# Altium schematic sheet Power.SchDoc
size 431 x 279 mm; SheetNumber: 1; SheetTotal: 4
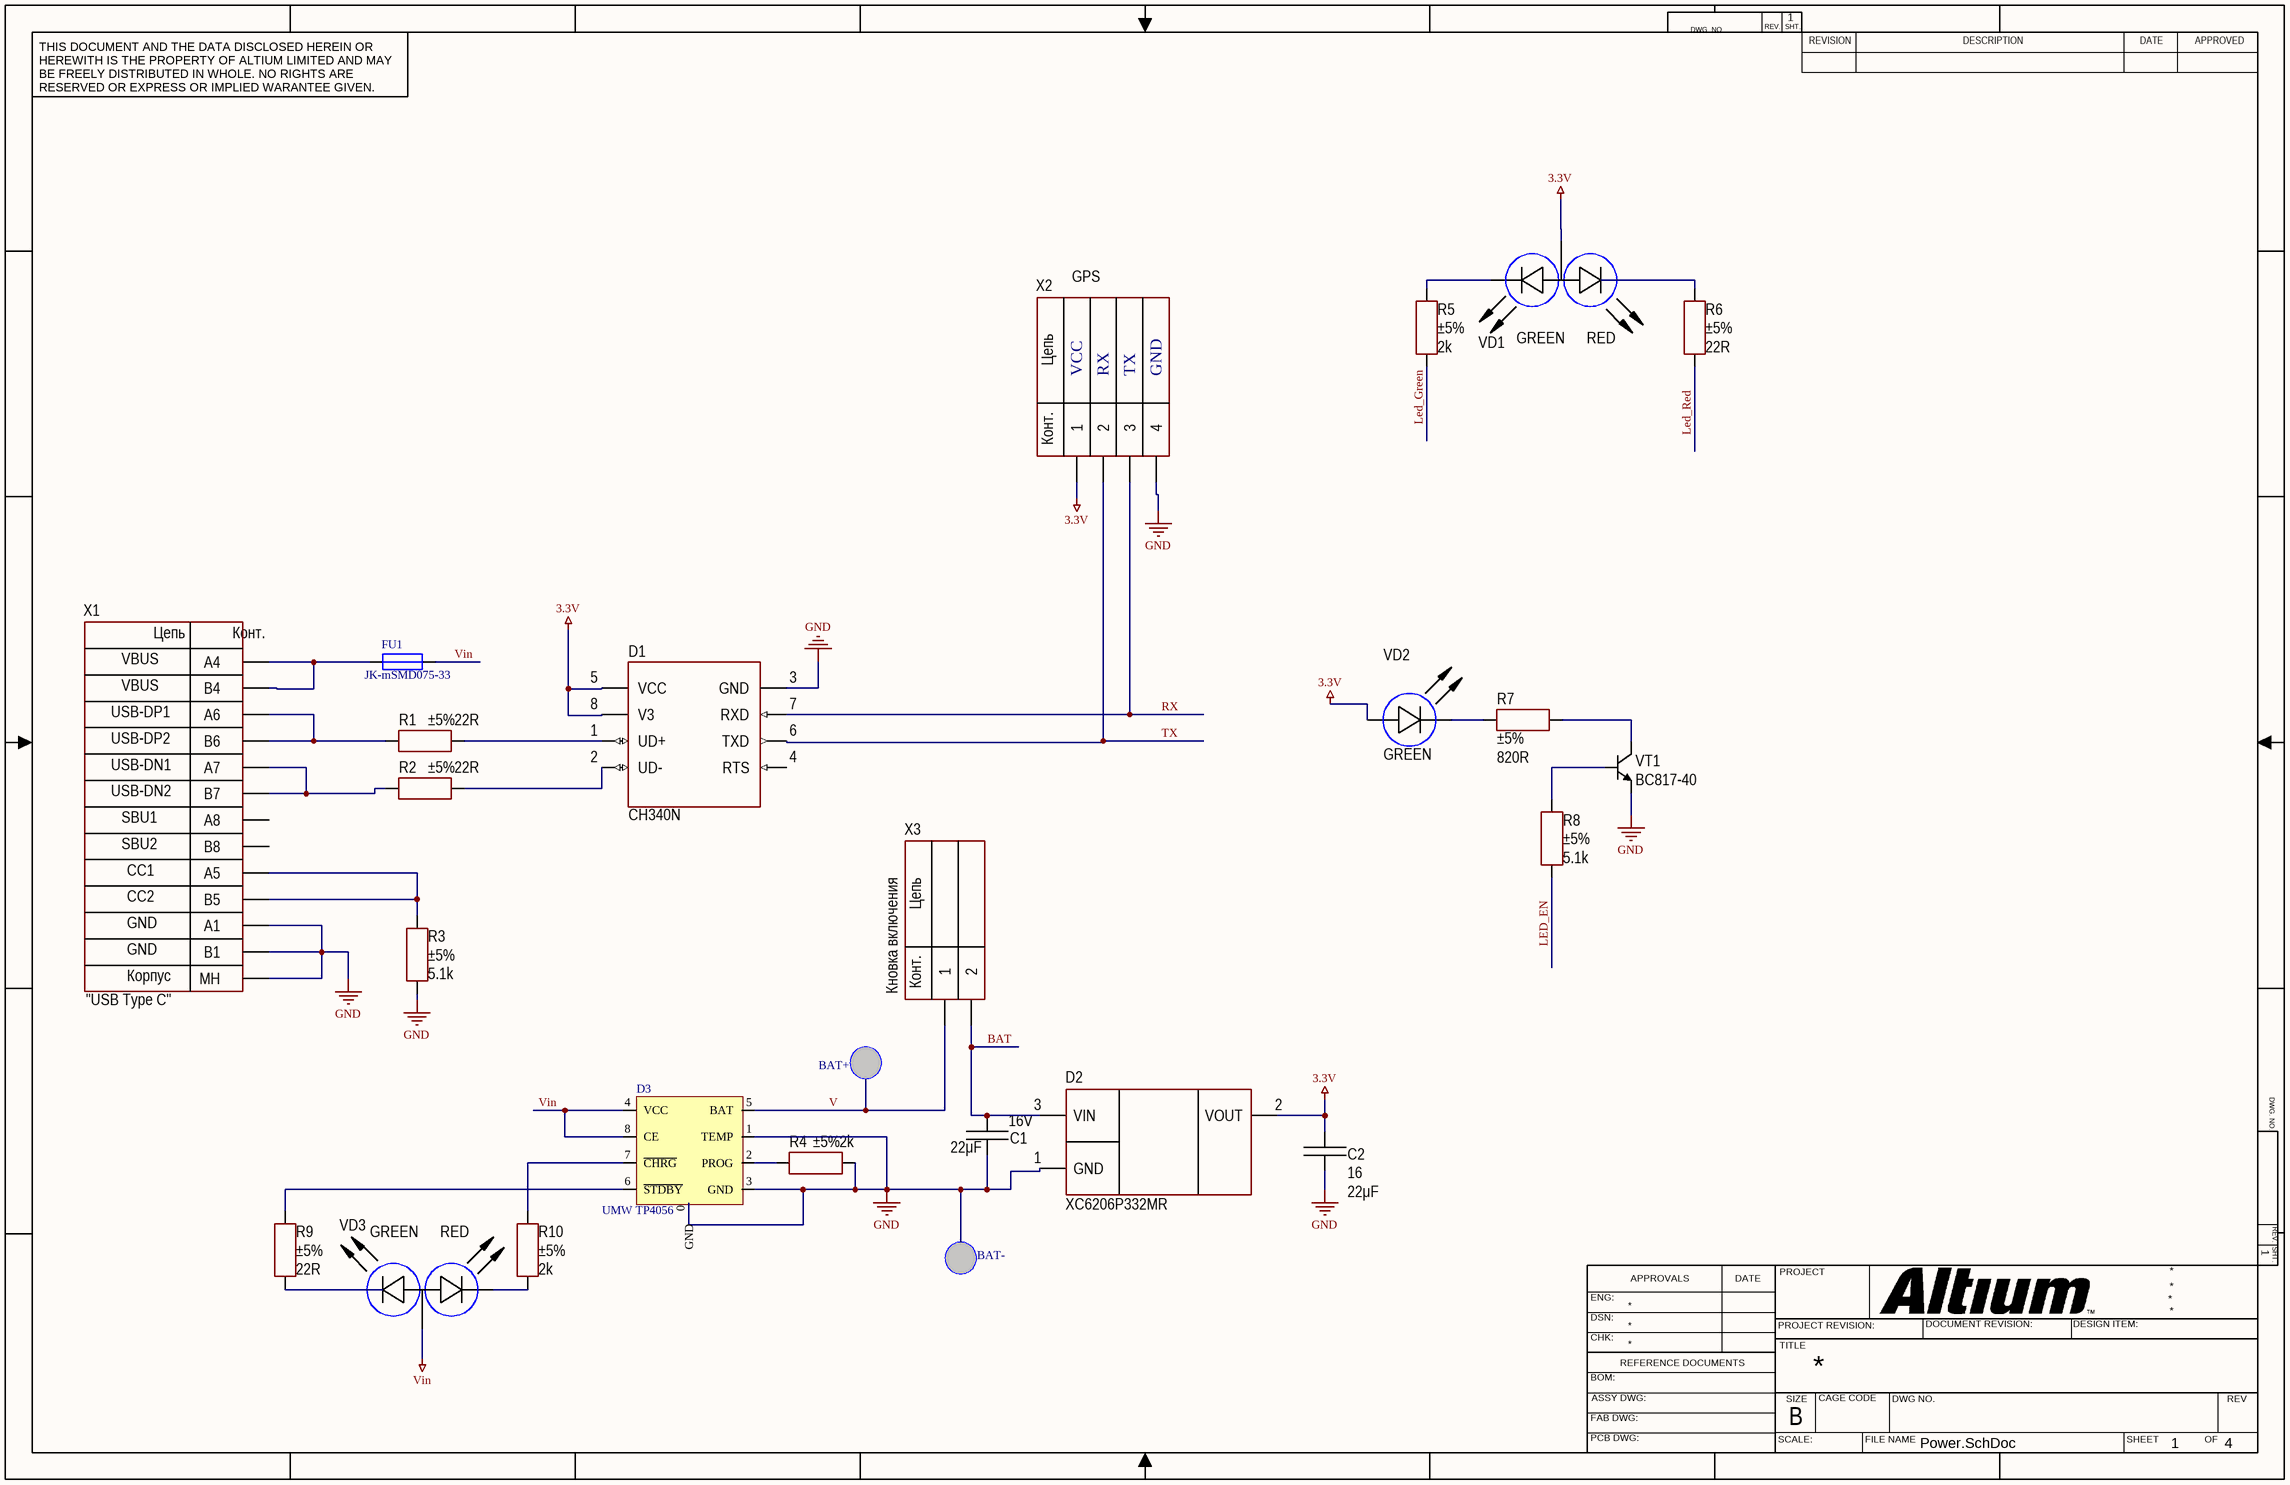
[diagram p0: Power.SchDoc]

## Parts
C1  value 22μF  Voltage: 16V  [CAP: 1206]
C2  value 22μF  Voltage: 16  [CAP: 1206]
D1  (no value)  [8-SOIC]
D2  PartNumber: XC6206P332MR  [SOT23]
D3  UMW TP4056  [SOP-8]
FU1  JK-mSMD075-33  [FUSE: 1812]
R1  value 22R  Tolerance: ±5%  [RES: 0805]
R2  value 22R  Tolerance: ±5%  [RES: 0805]
R3  value 5.1k  Tolerance: ±5%  [RES: 0805]
R4  value 2k  Tolerance: ±5%  [RES: 0805]
R5  value 2k  Tolerance: ±5%  [RES: 0805]
R6  value 22R  Tolerance: ±5%  [RES: 0805]
R7  value 820R  Tolerance: ±5%  [RES: 0805]
R8  value 5.1k  Tolerance: ±5%  [RES: 0805]
R9  value 22R  Tolerance: ±5%  [RES: 0805]
R10  value 2k  Tolerance: ±5%  [RES: 0805]
VD1  Color: GREEN      RED  [DIODE: LED3MM_DUAL]
VD2  Color: GREEN  [DIODE: LED3MM_Y]
VD3  Color: GREEN      RED  [DIODE: LED3MM_DUAL]
VT1  PartNumber: ВС817-40  [SOT23]
X1  CommentText: "USB Type C"  [CON: TYPE-C-31-M-12]
X2  CommentText: GPS  [CON: PLS-4]
X3  CommentText: Кновка включения  [CON: PLS-2]

## Nets
3.3V: C2.2 D1.5(VCC) D1.8(V3) D2.2(VOUT) VD1.2(A) VD2.1(A) X2.1
GND: C1.1 C2.1 D1.3(GND) D2.1(GND) D3.0(GND) D3.1(TEMP) D3.3(GND) R3.1 R4.2 VT1.2(E) X1.A1 X1.B1 X1.MH X2.4
Vin: D3.4(VCC) D3.8(CE) FU1.2 VD3.2(A)
BAT: C1.2 D2.3(VIN) X3.2
LED_EN: R8.2
Led_Green: R5.2
Led_Red: R6.2
RX: D1.7(RXD) X2.3
TX: D1.6(TXD) X2.2
V: D3.5(BAT) X3.1
NetD1_1: D1.1(UD+) R1.2
NetD1_2: D1.2(UD-) R2.2
NetD3_2: D3.2(PROG) R4.1
NetD3_6: D3.6(~{STDBY}) R9.2
NetD3_7: D3.7(~{CHRG}) R10.2
NetFU1_1: FU1.1 X1.A4 X1.B4
NetR1_1: R1.1 X1.A6 X1.B6
NetR2_1: R2.1 X1.A7 X1.B7
NetR3_2: R3.2 X1.A5 X1.B5
NetR5_1: R5.1 VD1.3(C)
NetR6_1: R6.1 VD1.1(C)
NetR7_1: R7.1 VD2.2(C)
NetR7_2: R7.2 VT1.3(C)
NetR8_1: R8.1 VT1.1(B)
NetR9_1: R9.1 VD3.1(C)
NetR10_1: R10.1 VD3.3(C)

Not connected (* = marked no-connect by the designer): D1 4(RTS); X1 A8 B8

## Notes on the sheet
- VCC
- RX
- TX
- GND
- BAT+
- BAT-
- DWG. NO.
- REV.
- SHT.
- THIS DOCUMENT AND THE DATA DISCLOSED HEREIN OR HEREWITH IS THE PROPERTY OF ALTIUM LIMITED AND MAY BE FREELY DISTRIBUTED IN WHOLE. NO RIGHTS ARE RESERVED OR EXPRESS OR IMPLIED WARANTEE GIVEN.
- REVISION
- DESCRIPTION
- DATE
- APPROVED
- ENG:
- APPROVALS
- PROJECT
- DSN:
- CHK:
- REFERENCE DOCUMENTS
- PROJECT REVISION:
- TITLE
- DOCUMENT REVISION:
- DESIGN ITEM:
- BOM:
- FAB DWG:
- PCB DWG:
- ASSY DWG:
- SCALE:
- SIZE
- B
- CAGE CODE
- FILE NAME
- DWG NO.
- SHEET
- OF
- REV
- (in symbol Connector_USB_Type_C) Цепь; Конт.; VBUS; USB-DP1; USB-DP2; USB-DN1; USB-DN2; SBU1; SBU2; CC1; CC2; GND; Корпус
- (in symbol PLS-2) Цепь; Конт.
- (in symbol PLS-4) Цепь; Конт.

## Library data of the parts
C1 = Ceramic_1206: Manufacturer: Yageo; ValueManufacturerPartNumber: Ceramic capacitor, 22μF, X5R, ±20%, 16V, 1206, -55...+125°C; TypeCapacitor: Ceramic capacitor; Tolerance: ±20%; TypeDielectric: X5R; Package: 1206; HelpURL: https://www.digikey.com/product-detail/en/yageo/CC1206KRX7R9BB104/311-1179-1-ND/303089; Temperature: -55...+125°C
C2 = Ceramic_1206: Manufacturer: Yageo; ValueManufacturerPartNumber: Ceramic capacitor, 22μF, X5R, ±20%, 16, 1206, -55...+125°C; TypeCapacitor: Ceramic capacitor; Tolerance: ±20%; TypeDielectric: X5R; Package: 1206; HelpURL: https://www.digikey.com/product-detail/en/yageo/CC1206KRX7R9BB104/311-1179-1-ND/303089; Temperature: -55...+125°C
D1 = CH340N: USB-to-UART; Manufacturer: WCH(Jiangsu Qin Heng); ValueManufacturerPartNumber: IC usb-to-uart bridge, USB2.0, 3...3.6V, -40...+85°C, 8- SOP; Supply: 3...3.6V; HelpURL: https://lcsc.com/product-detail/USB-ICs_WCH-Jiangsu-Qin-Heng-CH340G_C14267.html; Package: 8- SOP; ComponentType: IC usb-to-uart bridge; Temperature: -40...+85°C; Standard: USB2.0; PartNumber: CH340N
D2 = XC6206: Linear voltage regulator; Manufacturer: Torex; ValueManufacturerPartNumber: Linear voltage regulator, max input 6V, 0.25V, output 3.3V, 200mA, -40...+85°C, SOT-23; VoltageInput: max input 6V; MaxDropout: 0.25V; CurrentOutput: 200mA; VoltageOutput: output 3.3V; HelpURL: https://www.chipdip.ru/product/xc6206p332mr-torex; Package: SOT-23; ComponentType: Linear voltage regulator; Temperature: -40...+85°C
D3 = D TP4056-42-ESOP8: Микросхема TP4056-42-ESOP8; ComponentLink1Description: Manufacturer URL; ComponentLink1URL: http://www.microchip.com/; ComponentLink2Description: Datasheet; ComponentLink2URL: http://ww1.microchip.com/downloads/en/DeviceDoc/22005b.pdf; ComponentLink3Description: Package Specification; ComponentLink3URL: http://www.microchip.com/stellent/groups/techpub_sg/documents/packagingspec/en012702.pdf; www: https://www.chipdip.ru/product/tp4056-umw; Manual: https://static.chipdip.ru/lib/747/DOC012747467.pdf
FU1 = JK-mSMD075-33: Предохраниетель ток срабатывания 1,5А, ток удержания 750мА; Manuf: JINRUI; Current: 1.5A
R1 R2 R6 R9 = Resistor_0805: Manufacturer: Yageo; PartNumber: RC0805JR-0722RL; ValueManufacturerPartNumber: Resistor film, 22R, ±5%, 0805, 0.125W, -55...+125°C; TypeResistor: Resistor film; Power: 0.125W; Package: 0805; HelpURL: https://www.digikey.com/product-detail/en/yageo/RC0805JR-07100RL/311-100ARCT-ND/731185; Temperature: -55...+125°C
R3 R8 = Resistor_0805: Manufacturer: Yageo; PartNumber: RC0805JR-075K1L; ValueManufacturerPartNumber: Resistor film, 5.1k, ±5%, 0805, 0.125W, -55...+125°C; TypeResistor: Resistor film; Power: 0.125W; Package: 0805; HelpURL: https://www.digikey.com/product-detail/en/yageo/RC0805JR-07100RL/311-100ARCT-ND/731185; Temperature: -55...+125°C
R4 R5 R10 = Resistor_0805: Manufacturer: Yageo; PartNumber: RC0805JR-0712KL; ValueManufacturerPartNumber: Resistor film, 2k, ±5%, 0805, 0.125W, -55...+125°C; TypeResistor: Resistor film; Power: 0.125W; Package: 0805; HelpURL: https://www.digikey.com/product-detail/en/yageo/RC0805JR-07100RL/311-100ARCT-ND/731185; Temperature: -55...+125°C
R7 = Resistor_0805: Manufacturer: Yageo; PartNumber: RC0805JR-07820RL; ValueManufacturerPartNumber: Resistor film, 820R, ±5%, 0805, 0.125W, -55...+125°C; TypeResistor: Resistor film; Power: 0.125W; Package: 0805; HelpURL: https://www.digikey.com/product-detail/en/yageo/RC0805JR-07100RL/311-100ARCT-ND/731185; Temperature: -55...+125°C
VD1 VD3 = LED_DUAL_3mm: ValueManufacturerPartNumber: LED, Green, *, *, 3mm, -55...+150°C; TypeDiode: LED; ColorParameter: Green; Manufacturer: *; Package: 3mm; HelpURL: *; Temperature: -55...+150°C; Current: *; VoltageDrop: *; PartNumber: *
VD2 = LED_single_3mm: ValueManufacturerPartNumber: LED, Green, *, *, *, -55...+150°C; TypeDiode: LED; Manufacturer: *; Package: *; HelpURL: *; Temperature: -55...+150°C; Current: *; VoltageDrop: *; PartNumber: *; ColorParameter: Green
VT1 = BJT_NPN_132: Manufacturer: ON Semiconductor; ValueManufacturerPartNumber: NPN transistor, 45V, 100mA, 100MHz, 250mW, 0.6V, 420, SOT-23, -55...+125°C; TypeTransistor: NPN transistor; VoltageCE: 45V; CurrentCE: 100mA; VoltageSaturation: 0.6V; Frequency: 100MHz; CurrentGain: 420; MaxPower: 250mW; Package: SOT-23; HelpURL: https://www.digikey.com/product-detail/en/on-semiconductor/BC847CLT1G/BC847CLT1GOSCT-ND/917836; Temperature: -55...+125°C
X1 = Connector_USB_Type_C: Manufacturer: Korean Hroparts; ValueManufacturerPartNumber: USB Type C, 3A; PartNumber: TYPE-C-31-M-12; TypeConnector: USB Type C; CurrentMax: 3A; HelpURL: https://lcsc.com/product-detail/USB-Type-C_Korean-Hroparts-Elec-TYPE-C-31-M-12_C165948.html
X2 = PLS-4: Manufacturer: Connfly; ValueManufacturerPartNumber: Connector, 4pin, 2.54mm, 500VAC, 3A; TypeConnector: Connector; VoltageMax: 500VAC; Pitch: 2.54mm; CurrentMax: 3A; Multichannel: 4pin; HelpURL: https://www.chipdip.ru/product/pls-4; PartNumber: PLS-4
X3 = PLS-2: Manufacturer: Connfly; ValueManufacturerPartNumber: Connector, 2pin, 2.54mm, 500VAC, 3A; TypeConnector: Connector; VoltageMax: 500VAC; Pitch: 2.54mm; CurrentMax: 3A; Multichannel: 2pin; HelpURL: https://www.chipdip.ru/product/pls-2; PartNumber: PLS-2